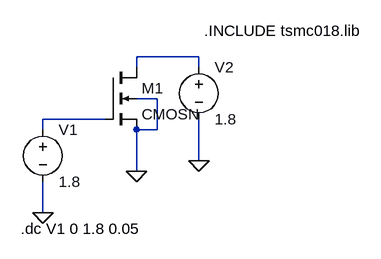
[diagram p0: schematic Draft1.asc]
Draft1.asc, the LTspice schematic file:
Version 4
SHEET 1 880 680
WIRE 240 144 144 144
WIRE 144 160 144 144
WIRE 240 160 240 144
WIRE 176 208 144 208
WIRE 96 240 0 240
WIRE 0 256 0 240
WIRE 176 256 176 208
WIRE 176 256 144 256
WIRE 240 304 240 240
WIRE 144 320 144 256
WIRE 0 384 0 336
FLAG 144 320 0
FLAG 240 304 0
FLAG 0 384 0
SYMBOL cmosn 96 160 R0
SYMATTR InstName M1
SYMATTR Value2 l=180n w=1u
SYMBOL voltage 0 240 R0
WINDOW 123 0 0 Left 0
WINDOW 39 0 0 Left 0
SYMATTR InstName V1
SYMATTR Value 1.8
SYMBOL voltage 240 144 R0
WINDOW 123 0 0 Left 0
WINDOW 39 0 0 Left 0
SYMATTR InstName V2
SYMATTR Value 1.8
TEXT 248 104 Left 2 !.INCLUDE tsmc018.lib
TEXT -34 408 Left 2 !.dc V1 0 1.8 0.05

The netlist it stands for:
* Draft1.asc
M1 N001 N002 0 0 CMOSN l=180n w=1u
V1 N002 0 1.8
V2 N001 0 1.8
.model NMOS NMOS
.model PMOS PMOS
.lib standard.mos
.INCLUDE tsmc018.lib
.dc V1 0 1.8 0.05
.backanno
.end